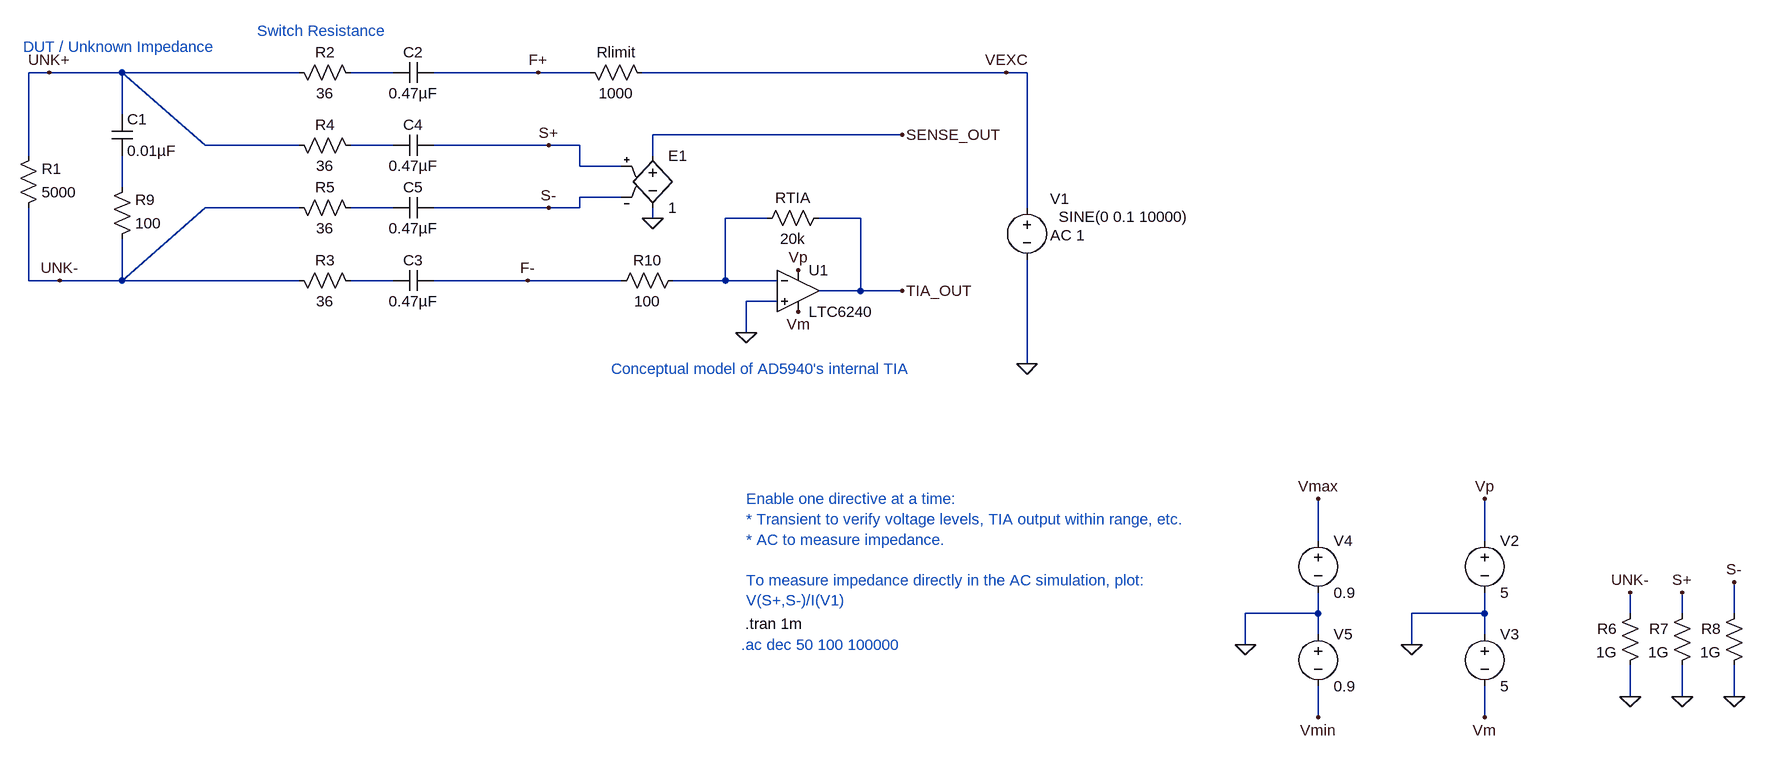
[diagram p0: schematic CN0565 Signal Chain Simulation Circuit.asc]
CN0565 Signal Chain Simulation Circuit.asc, the LTspice schematic file:
Version 4
SHEET 1 1904 872
WIRE -720 -224 -752 -224
WIRE -608 -224 -720 -224
WIRE -336 -224 -608 -224
WIRE -192 -224 -256 -224
WIRE 32 -224 -128 -224
WIRE 112 -224 32 -224
WIRE 752 -224 192 -224
WIRE 784 -224 752 -224
WIRE -608 -160 -608 -224
WIRE 592 -128 208 -128
WIRE -480 -112 -608 -224
WIRE -336 -112 -480 -112
WIRE -192 -112 -256 -112
WIRE 48 -112 -128 -112
WIRE 96 -112 48 -112
WIRE -752 -96 -752 -224
WIRE 208 -96 208 -128
WIRE 96 -80 96 -112
WIRE 160 -80 96 -80
WIRE -608 -48 -608 -96
WIRE 160 -32 96 -32
WIRE -336 -16 -480 -16
WIRE -192 -16 -256 -16
WIRE 48 -16 -128 -16
WIRE 96 -16 96 -32
WIRE 96 -16 48 -16
WIRE 784 -16 784 -224
WIRE 208 0 208 -16
WIRE 384 0 320 0
WIRE 528 0 464 0
WIRE -752 96 -752 -16
WIRE -704 96 -752 96
WIRE -608 96 -480 -16
WIRE -608 96 -608 32
WIRE -608 96 -704 96
WIRE -336 96 -608 96
WIRE -192 96 -256 96
WIRE 16 96 -128 96
WIRE 160 96 16 96
WIRE 320 96 320 0
WIRE 320 96 240 96
WIRE 400 96 320 96
WIRE 528 112 528 0
WIRE 528 112 464 112
WIRE 592 112 528 112
WIRE 400 128 352 128
WIRE 352 176 352 128
WIRE 784 224 784 64
WIRE 1232 496 1232 432
WIRE 1488 496 1488 432
WIRE 1232 608 1232 576
WIRE 1232 608 1120 608
WIRE 1488 608 1488 576
WIRE 1488 608 1376 608
WIRE 1712 608 1712 576
WIRE 1792 608 1792 576
WIRE 1872 608 1872 560
WIRE 1232 640 1232 608
WIRE 1488 640 1488 608
WIRE 1120 656 1120 608
WIRE 1376 656 1376 608
WIRE 1712 736 1712 688
WIRE 1792 736 1792 688
WIRE 1872 736 1872 688
WIRE 1232 768 1232 720
WIRE 1488 768 1488 720
FLAG 784 224 0
FLAG 1712 736 0
FLAG 1792 736 0
FLAG 1872 736 0
FLAG 48 -112 S+
FLAG 48 -16 S-
FLAG 32 -224 F+
FLAG 1376 656 0
FLAG 1488 432 Vp
FLAG 432 80 Vp
FLAG 1488 768 Vm
FLAG 432 144 Vm
FLAG 352 176 0
FLAG 592 112 TIA_OUT
FLAG -720 -224 UNK+
FLAG -704 96 UNK-
FLAG 1712 576 UNK-
FLAG 1872 560 S-
FLAG 1792 576 S+
FLAG 752 -224 VEXC
FLAG 208 0 0
FLAG 592 -128 SENSE_OUT
FLAG 16 96 F-
FLAG 1120 656 0
FLAG 1232 432 Vmax
FLAG 1232 768 Vmin
SYMBOL voltage 784 -32 M0
WINDOW 3 -249 30 Left 2
WINDOW 123 -89 58 Left 2
WINDOW 39 0 0 Left 0
WINDOW 0 -65 2 Left 2
SYMATTR Value SINE(0 0.1 10000)
SYMATTR Value2 AC 1
SYMATTR InstName V1
SYMBOL res -768 0 M180
WINDOW 0 36 76 Left 2
WINDOW 3 36 40 Left 2
SYMATTR InstName R1
SYMATTR Value 5000
SYMBOL cap -624 -96 M180
WINDOW 0 24 56 Left 2
WINDOW 3 24 8 Left 2
SYMATTR InstName C1
SYMATTR Value 0.01µF
SYMBOL res -352 -240 M90
WINDOW 0 0 56 VBottom 2
WINDOW 3 32 56 VTop 2
SYMATTR InstName R2
SYMATTR Value 36
SYMBOL res -352 80 M90
WINDOW 0 0 56 VBottom 2
WINDOW 3 32 56 VTop 2
SYMATTR InstName R3
SYMATTR Value 36
SYMBOL cap -192 -240 M90
WINDOW 0 0 32 VBottom 2
WINDOW 3 32 32 VTop 2
SYMATTR InstName C2
SYMATTR Value 0.47µF
SYMBOL cap -192 80 M90
WINDOW 0 0 32 VBottom 2
WINDOW 3 32 32 VTop 2
SYMATTR InstName C3
SYMATTR Value 0.47µF
SYMBOL res -352 -128 M90
WINDOW 0 0 56 VBottom 2
WINDOW 3 32 56 VTop 2
SYMATTR InstName R4
SYMATTR Value 36
SYMBOL cap -192 -128 M90
WINDOW 0 0 32 VBottom 2
WINDOW 3 32 32 VTop 2
SYMATTR InstName C4
SYMATTR Value 0.47µF
SYMBOL res -352 -32 M90
WINDOW 0 0 56 VBottom 2
WINDOW 3 32 56 VTop 2
SYMATTR InstName R5
SYMATTR Value 36
SYMBOL cap -192 -32 M90
WINDOW 0 0 32 VBottom 2
WINDOW 3 32 32 VTop 2
SYMATTR InstName C5
SYMATTR Value 0.47µF
SYMBOL res 1728 592 M0
SYMATTR InstName R6
SYMATTR Value 1G
SYMBOL res 1808 592 M0
SYMATTR InstName R7
SYMATTR Value 1G
SYMBOL res 1888 592 M0
SYMATTR InstName R8
SYMATTR Value 1G
SYMBOL OpAmps\\LTC6240 432 112 R0
SYMATTR InstName U1
SYMBOL voltage 1488 480 R0
WINDOW 123 0 0 Left 0
WINDOW 39 0 0 Left 0
SYMATTR InstName V2
SYMATTR Value 5
SYMBOL voltage 1488 624 R0
WINDOW 123 0 0 Left 0
WINDOW 39 0 0 Left 0
SYMATTR InstName V3
SYMATTR Value 5
SYMBOL res 480 -16 R90
WINDOW 0 0 56 VBottom 2
WINDOW 3 32 56 VTop 2
SYMATTR InstName RTIA
SYMATTR Value 20k
SYMBOL res 256 80 R90
WINDOW 0 0 56 VBottom 2
WINDOW 3 32 56 VTop 2
SYMATTR InstName R10
SYMATTR Value 100
SYMBOL res -624 48 M180
WINDOW 0 36 76 Left 2
WINDOW 3 36 40 Left 2
SYMATTR InstName R9
SYMATTR Value 100
SYMBOL res 96 -240 M90
WINDOW 0 0 56 VBottom 2
WINDOW 3 32 56 VTop 2
SYMATTR InstName Rlimit
SYMATTR Value 1000
SYMBOL e 208 -112 R0
SYMATTR InstName E1
SYMATTR Value 1
SYMBOL voltage 1232 480 R0
WINDOW 123 0 0 Left 0
WINDOW 39 0 0 Left 0
SYMATTR InstName V4
SYMATTR Value 0.9
SYMBOL voltage 1232 624 R0
WINDOW 123 0 0 Left 0
WINDOW 39 0 0 Left 0
SYMATTR InstName V5
SYMATTR Value 0.9
TEXT 440 624 Right 2 !.tran 1m
TEXT 344 656 Left 2 ;.ac dec 50 100 100000
TEXT 352 432 Left 2 ;Enable one directive at a time:\n* Transient to verify voltage levels, TIA output within range, etc.\n* AC to measure impedance.\n \nTo measure impedance directly in the AC simulation, plot:\nV(S+,S-)/I(V1)
TEXT 144 232 Left 2 ;Conceptual model of AD5940's internal TIA
TEXT -400 -288 Left 2 ;Switch Resistance
TEXT -760 -264 Left 2 ;DUT / Unknown Impedance

The netlist it stands for:
* CN0565 Signal Chain Simulation Circuit.asc
V1 VEXC 0 SINE(0 0.1 10000) AC 1
R1 UNK- UNK+ 5000
C1 N003 UNK+ 0.01µF
R2 UNK+ N001 36
R3 UNK- N006 36
C2 N001 F+ 0.47µF
C3 N006 F- 0.47µF
R4 UNK+ N002 36
C4 N002 S+ 0.47µF
R5 UNK- N004 36
C5 N004 S- 0.47µF
R6 UNK- 0 1G
R7 S+ 0 1G
R8 S- 0 1G
* U1: LTC6240 (symbol OpAmps\LTC6240 not available, pins judged from their places): In+=0 In-=N005 V+=Vp V-=Vm OUT=TIA_OUT
V2 Vp 0 5
V3 0 Vm 5
RTIA TIA_OUT N005 20k
R10 N005 F- 100
R9 UNK- N003 100
Rlimit F+ VEXC 1000
E1 SENSE_OUT 0 S+ S- 1
V4 Vmax 0 0.9
V5 0 Vmin 0.9
.tran 1m
* .ac dec 50 100 100000
* Enable one directive at a time:
* * Transient to verify voltage levels, TIA output within range, etc.
* * AC to measure impedance.
* To measure impedance directly in the AC simulation, plot:
* V(S+,S-)/I(V1)
* Conceptual model of AD5940's internal TIA
* Switch Resistance
* DUT / Unknown Impedance
.backanno
.end